# EAGLE design CV-module-schematics (EAGLE 6.2)
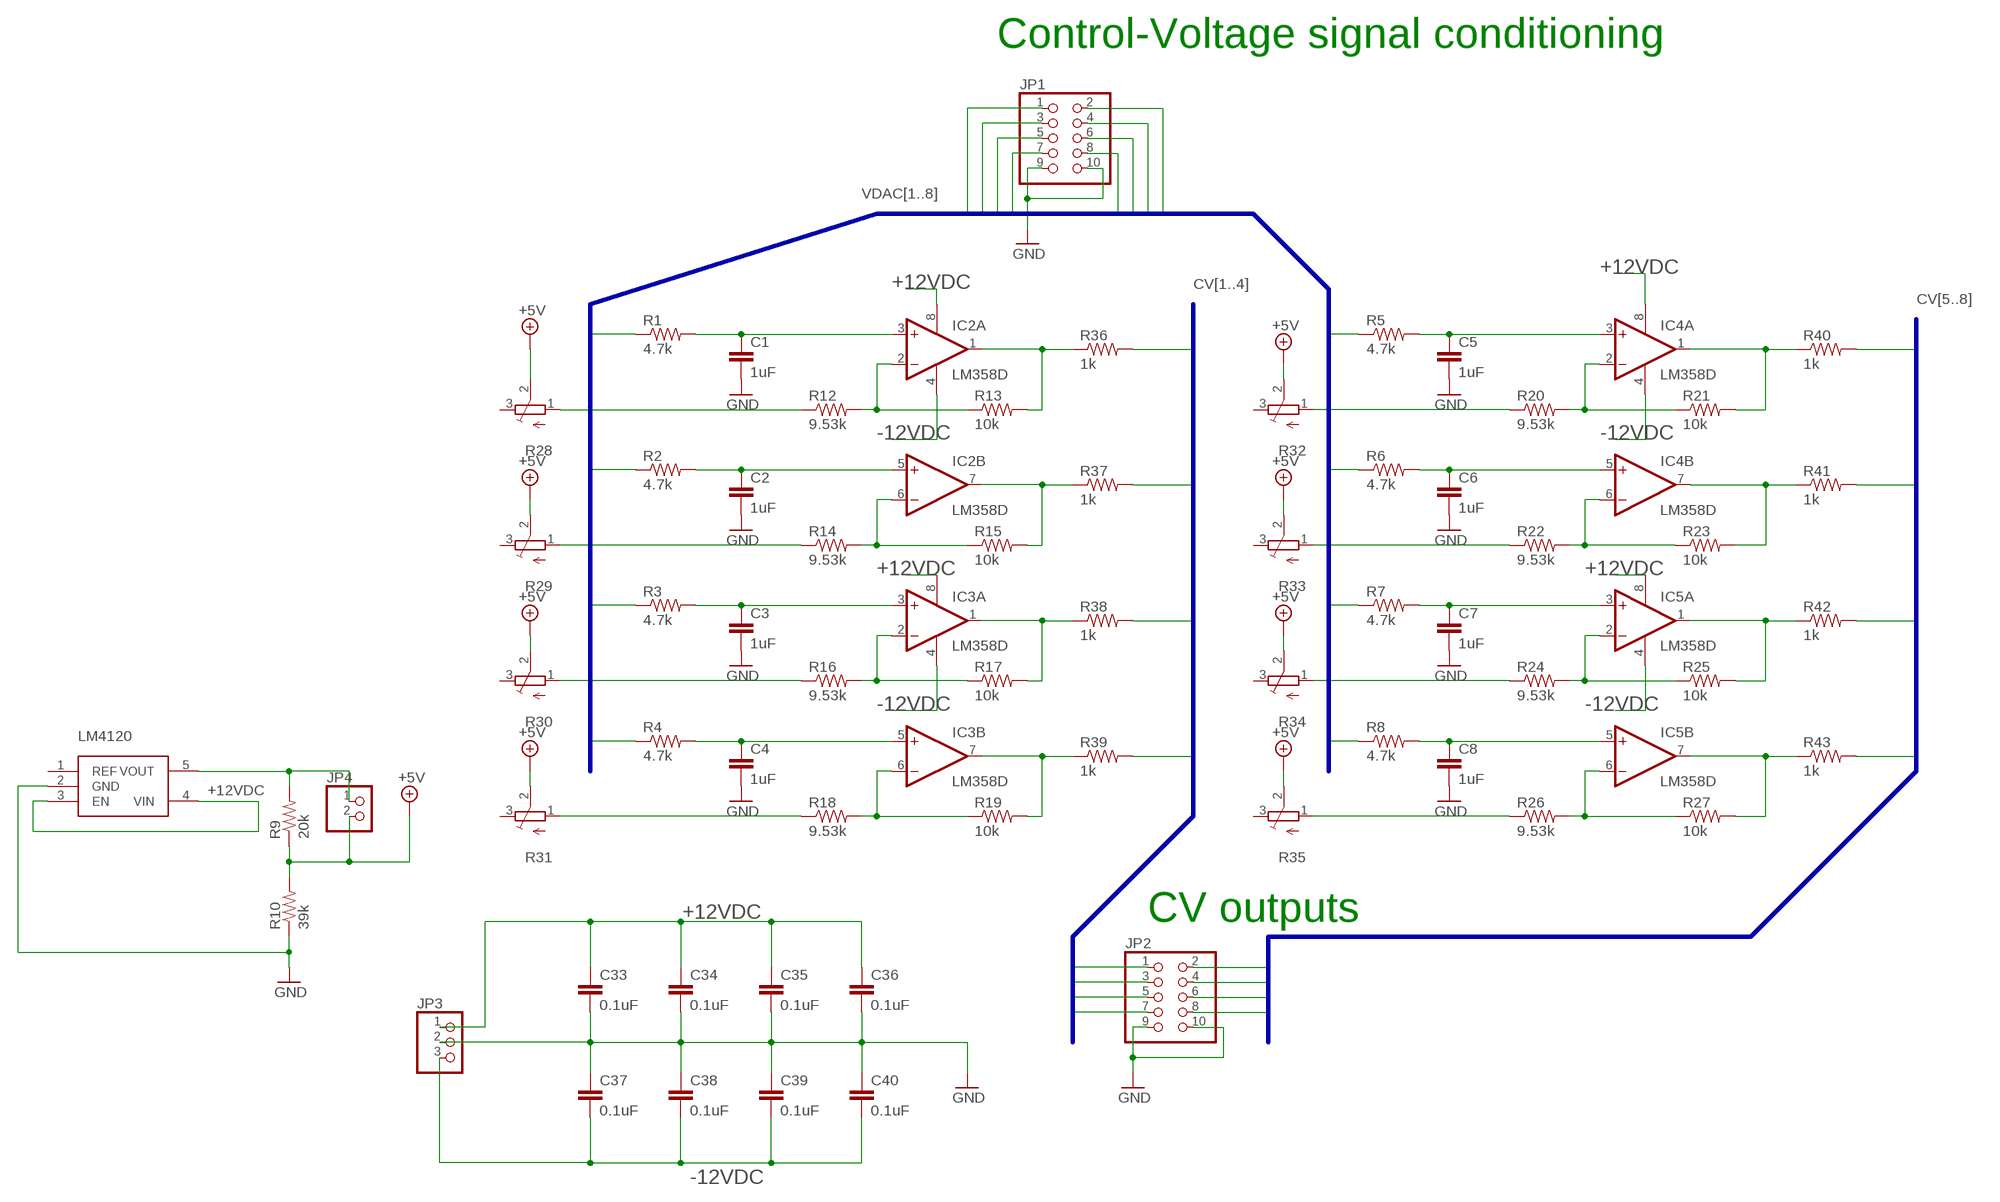
[diagram p0: schematic, sheet 1]

## Parts
C1  1uF  C-EUC0603  [C0603]
C2  1uF  C-EUC0603  [C0603]
C3  1uF  C-EUC0603  [C0603]
C4  1uF  C-EUC0603  [C0603]
C5  1uF  C-EUC0603  [C0603]
C6  1uF  C-EUC0603  [C0603]
C7  1uF  C-EUC0603  [C0603]
C8  1uF  C-EUC0603  [C0603]
C33  0.1uF  C-EUC0603  [C0603]
C34  0.1uF  C-EUC0603  [C0603]
C35  0.1uF  C-EUC0603  [C0603]
C36  0.1uF  C-EUC0603  [C0603]
C37  0.1uF  C-EUC0603  [C0603]
C38  0.1uF  C-EUC0603  [C0603]
C39  0.1uF  C-EUC0603  [C0603]
C40  0.1uF  C-EUC0603  [C0603]
IC2  LM358D  [SO08]
IC3  LM358D  [SO08]
IC4  LM358D  [SO08]
IC5  LM358D  [SO08]
JP1  PINHD-2X5  [2X05]
JP2  PINHD-2X5  [2X05]
JP3  PINHD-1X3  [1X03]
JP4  PINHD-1X2  [1X02]
LM4120  LM4120  [SOT23-5]
R1  4.7k  R-US_R0603  [R0603]
R2  4.7k  R-US_R0603  [R0603]
R3  4.7k  R-US_R0603  [R0603]
R4  4.7k  R-US_R0603  [R0603]
R5  4.7k  R-US_R0603  [R0603]
R6  4.7k  R-US_R0603  [R0603]
R7  4.7k  R-US_R0603  [R0603]
R8  4.7k  R-US_R0603  [R0603]
R9  20k  R-US_R0603  [R0603]
R10  39k  R-US_R0603  [R0603]
R12  9.53k  R-US_R0603  [R0603]
R13  10k  R-US_R0603  [R0603]
R14  9.53k  R-US_R0603  [R0603]
R15  10k  R-US_R0603  [R0603]
R16  9.53k  R-US_R0603  [R0603]
R17  10k  R-US_R0603  [R0603]
R18  9.53k  R-US_R0603  [R0603]
R19  10k  R-US_R0603  [R0603]
R20  9.53k  R-US_R0603  [R0603]
R21  10k  R-US_R0603  [R0603]
R22  9.53k  R-US_R0603  [R0603]
R23  10k  R-US_R0603  [R0603]
R24  9.53k  R-US_R0603  [R0603]
R25  10k  R-US_R0603  [R0603]
R26  9.53k  R-US_R0603  [R0603]
R27  10k  R-US_R0603  [R0603]
R28  TRIM_EU-3222W  [3222W]
R29  TRIM_EU-3222W  [3222W]
R30  TRIM_EU-3222W  [3222W]
R31  TRIM_EU-3222W  [3222W]
R32  TRIM_EU-3222W  [3222W]
R33  TRIM_EU-3222W  [3222W]
R34  TRIM_EU-3222W  [3222W]
R35  TRIM_EU-3222W  [3222W]
R36  1k  R-US_R0603  [R0603]
R37  1k  R-US_R0603  [R0603]
R38  1k  R-US_R0603  [R0603]
R39  1k  R-US_R0603  [R0603]
R40  1k  R-US_R0603  [R0603]
R41  1k  R-US_R0603  [R0603]
R42  1k  R-US_R0603  [R0603]
R43  1k  R-US_R0603  [R0603]

## Nets
+5V: JP4.2 R9.1 R10.2 R28.2(S) R29.2(S) R30.2(S) R31.2(S) R32.2(S) R33.2(S) R34.2(S) R35.2(S)
+12VDC: C33.1 C34.1 C35.1 C36.1 IC2.8(P:V+) IC3.8(P:V+) IC4.8(P:V+) IC5.8(P:V+) JP3.1 LM4120.3(EN) LM4120.4(VIN)
-12VDC: C37.2 C38.2 C39.2 C40.2 IC2.4(P:V-) IC3.4(P:V-) IC4.4(P:V-) IC5.4(P:V-) JP3.3
CV1: JP2.1 R37.2
CV2: JP2.3 R36.2
CV3: JP2.5 R39.2
CV4: JP2.7 R38.2
CV5: JP2.2 R42.2
CV6: JP2.4 R43.2
CV7: JP2.6 R40.2
CV8: JP2.8 R41.2
GND: C1.2 C2.2 C3.2 C4.2 C5.2 C6.2 C7.2 C8.2 C33.2 C34.2 C35.2 C36.2 C37.1 C38.1 C39.1 C40.1 JP1.9 JP1.10 JP2.9 JP2.10 JP3.2 LM4120.2(GND) R10.1
N$1: C1.1 IC2.3(A:+IN) R1.2
N$2: C2.1 IC2.5(B:+IN) R2.2
N$3: C3.1 IC3.3(A:+IN) R3.2
N$4: IC2.2(A:-IN) R12.2 R13.1
N$5: R12.1 R28.1(A)
N$6: IC2.1(A:OUT) R13.2 R36.1
N$7: R14.1 R29.1(A)
N$8: IC2.6(B:-IN) R14.2 R15.1
N$9: IC3.2(A:-IN) R16.2 R17.1
N$10: R16.1 R30.1(A)
N$11: IC3.6(B:-IN) R18.2 R19.1
N$12: R18.1 R31.1(A)
N$13: IC3.7(B:OUT) R19.2 R39.1
N$14: IC3.1(A:OUT) R17.2 R38.1
N$15: IC2.7(B:OUT) R15.2 R37.1
N$16: IC4.2(A:-IN) R20.2 R21.1
N$17: IC4.1(A:OUT) R21.2 R40.1
N$18: IC4.7(B:OUT) R23.2 R41.1
N$19: IC4.6(B:-IN) R22.2 R23.1
N$20: IC5.2(A:-IN) R24.2 R25.1
N$21: IC5.1(A:OUT) R25.2 R42.1
N$22: R24.1 R34.1(A)
N$23: IC5.6(B:-IN) R26.2 R27.1
N$24: IC5.7(B:OUT) R27.2 R43.1
N$25: R26.1 R35.1(A)
N$26: R20.1 R32.1(A)
N$27: R22.1 R33.1(A)
N$28: C4.1 IC3.5(B:+IN) R4.2
N$29: C5.1 IC4.3(A:+IN) R5.2
N$30: C6.1 IC4.5(B:+IN) R6.2
N$31: C7.1 IC5.3(A:+IN) R7.2
N$32: C8.1 IC5.5(B:+IN) R8.2
N$34: JP4.1 LM4120.5(VOUT) R9.2
VDAC1: JP1.1 R1.1
VDAC2: JP1.2 R2.1
VDAC3: JP1.3 R3.1
VDAC4: JP1.4 R4.1
VDAC5: JP1.5 R5.1
VDAC6: JP1.6 R6.1
VDAC7: JP1.7 R7.1
VDAC8: JP1.8 R8.1
Unconnected: LM4120.1(REF) R28.3(E) R29.3(E) R30.3(E) R31.3(E) R32.3(E) R33.3(E) R34.3(E) R35.3(E)

## Buses
CV[1..4]
CV[5..8]
VDAC[1..8]

## Notes on the sheet
- Control-Voltage signal conditioning
- CV outputs

## Library data of the parts
C1-C8 C33-C40 = resistor:C-EU: CAPACITOR, European symbol
IC2-IC5 = linear:LM358: OP AMP also LM158; LM258; LM2904 Source: http://cache.national.com/ds/LM/LM158.pdf
JP1 JP2 = pinhead:PINHD-2X5: PIN HEADER
JP3 = pinhead:PINHD-1X3: PIN HEADER
JP4 = pinhead:PINHD-1X2: PIN HEADER
LM4120 = Pekkas_libraries:LM4120: LM4120 Precision Micropower Low Dropout Voltage Reference
R1-R10 R12-R27 R36-R43 = resistor:R-US_: RESISTOR, American symbol
R28-R35 = Pekkas_libraries:TRIM_EU-: POTENTIOMETER

## Board
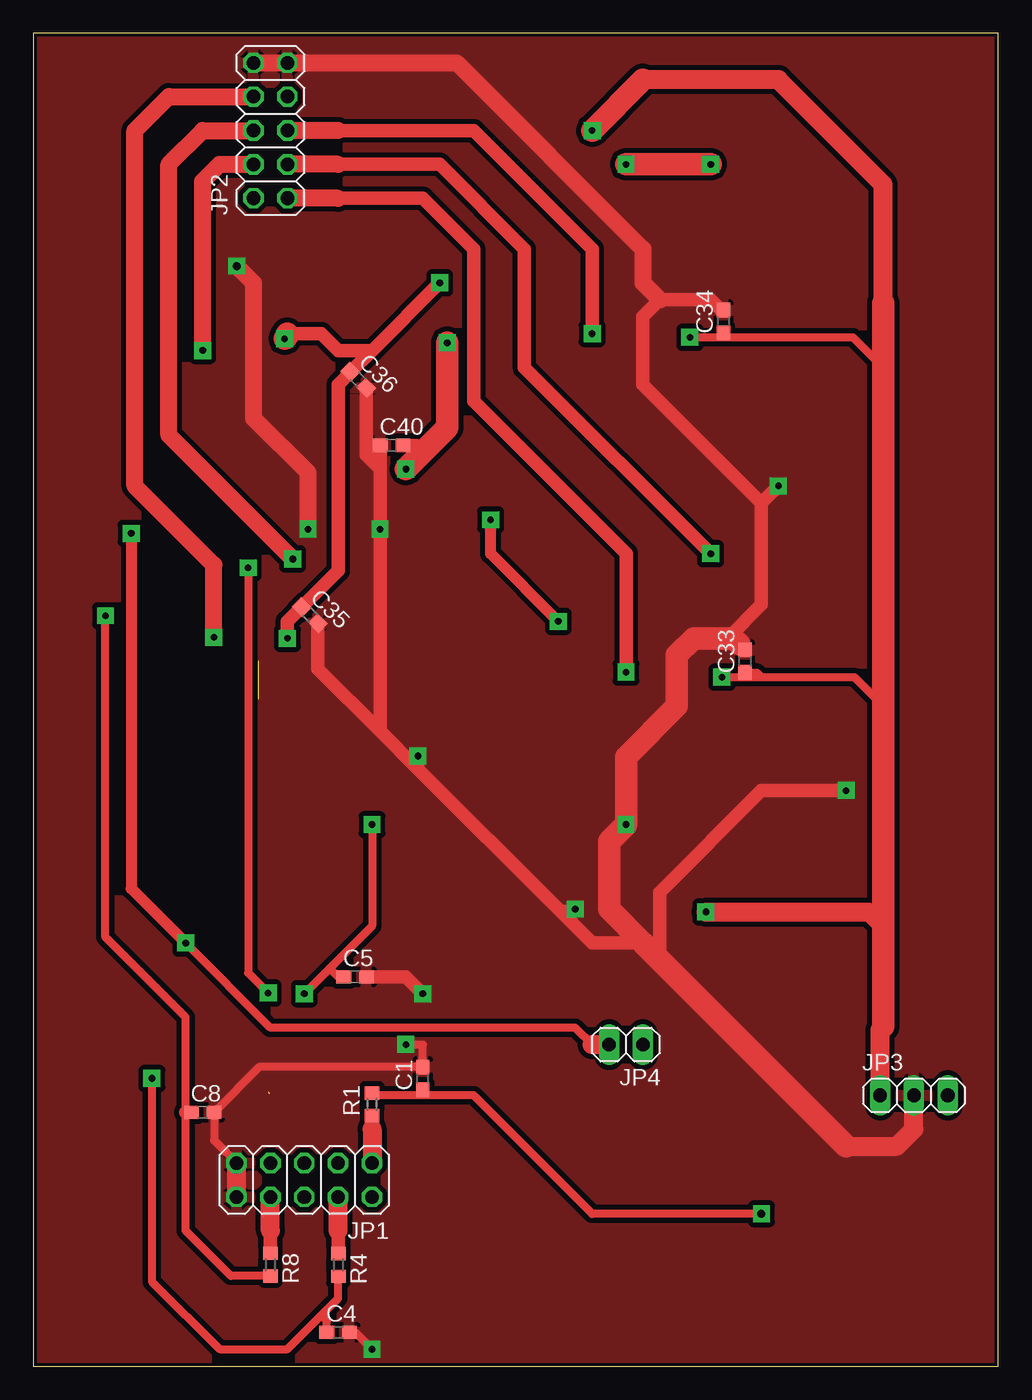
[diagram p1: board, top side]
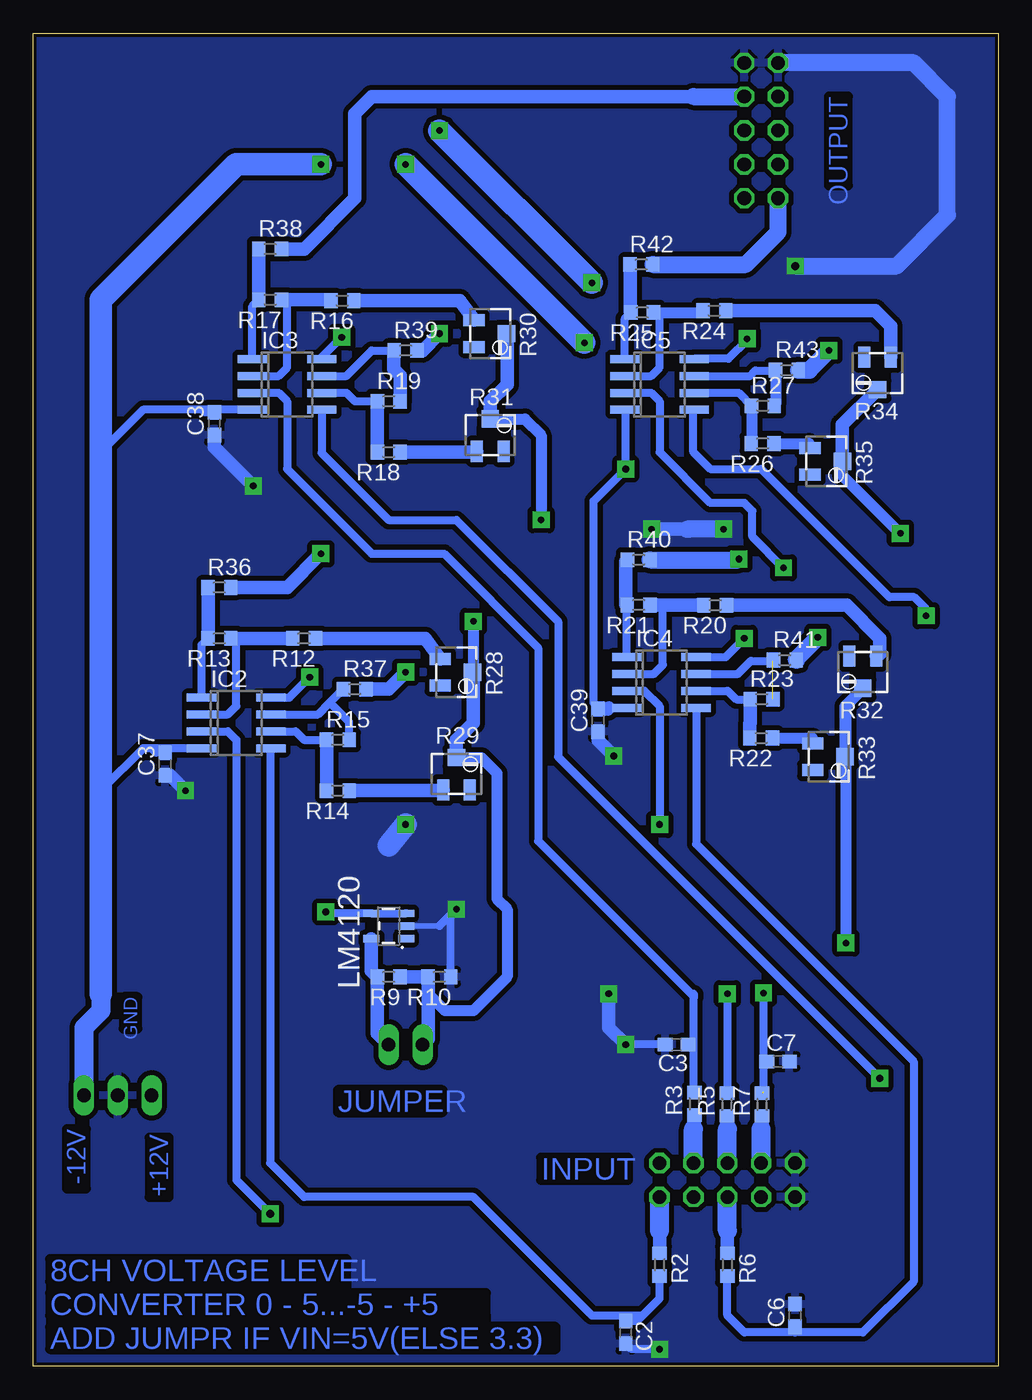
[diagram p2: board, bottom side, seen from below]

Size 72.37 x 100 mm. Coordinates in mm from the lower left corner, seen from the top.
Outline: 0,0 72.37,0 72.37,100 0,100 0,0
Copper layers (1*16): Top 0.035mm / dielectric 1.5mm / Bottom 0.035mm
Design rules: minimum track width 10mil, minimum drill 24mil, track to track 15mil, track to pad 10mil, pad to pad 10mil, via to via 10mil, smd to smd 8mil, copper to edge 10mil, drill to drill 8mil, minimum pad ring 10mil, minimum via ring 8mil, stop-mask expansion 4mil, vias tented up to drill 0mil, thermal gap 10mil

### Footprints (pad centres in the part's own frame; a part is rotated, then mirrored left to right if it is on the bottom)
C0603 = smd 1.1 x 1: 1 -0.85,0; 2 0.85,0
SO08 = smd 0.6 x 2.2: 1 -1.905,-2.6; 2 -0.635,-2.6; 3 0.635,-2.6; 4 1.905,-2.6; 5 1.905,2.6; 6 0.635,2.6; 7 -0.635,2.6; 8 -1.905,2.6
2X05 = drill 1.016 octagon: 1 -5.08,-1.27; 2 -5.08,1.27; 3 -2.54,-1.27; 4 -2.54,1.27; 5 0,-1.27; 6 0,1.27; 7 2.54,-1.27; 8 2.54,1.27; 9 5.08,-1.27; 10 5.08,1.27
1X03 = drill 1.016 long: 1 -2.54,0; 2 0,0; 3 2.54,0
1X02 = drill 1.016 long: 1 -1.27,0; 2 1.27,0
SOT23-5 = smd 0.55 x 1.2: 1 -0.95,-1.3; 2 0,-1.3; 3 0.95,-1.3; 4 0.95,1.3; 5 -0.95,1.3
R0603 = smd 1 x 1.1: 1 -0.85,0; 2 0.85,0
3222W = smd 0.9 x 1.6: 1 -1,-1.215; 3 1,-1.215 | smd 1.3 x 1.3: 2 0,1.215

### Placement (x,y rotation side)
C1  29.21,21.59 90 top
C2  27.94,2.54 270 bottom
C3  24.13,24.13 180 bottom
C4  22.86,2.54 0 top
C5  24.13,29.21 0 top
C6  15.24,3.81 90 bottom
C7  16.51,22.86 0 bottom
C8  12.7,19.05 0 top
C33  53.38,52.89 90 top
C34  51.76,78.38 90 top
C35  20.74,56.34 315 top
C36  24.37,74.01 315 top
C37  62.48,45.18 90 bottom
C38  58.79,70.71 90 bottom
C39  30.01,48.46 90 bottom
C40  26.87,69.08 0 top
IC2  57.15,48.26 270 bottom
IC3  53.34,73.66 270 bottom
IC4  25.26,51.3 270 bottom
IC5  25.4,73.66 270 bottom
JP1  20.32,13.97 180 top
JP2  17.78,92.71 90 top
JP3  66.04,20.32 0 top
JP4  44.45,24.13 180 top
LM4120  45.72,33.02 90 bottom
R1  25.4,19.65 90 top
R2  25.4,7.62 270 bottom
R3  22.79,19.68 90 bottom
R4  22.88,7.59 270 top
R5  20.35,19.63 90 bottom
R6  20.32,7.62 270 bottom
R7  17.71,19.63 90 bottom
R8  17.78,7.62 270 top
R9  45.72,29.21 180 bottom
R10  41.91,29.21 180 bottom
R12  52.07,54.61 180 bottom
R13  58.42,54.61 180 bottom
R14  49.53,43.18 180 bottom
R15  49.53,46.99 0 bottom
R16  49.19,79.94 180 bottom
R17  54.61,80.01 180 bottom
R18  45.72,68.58 180 bottom
R19  45.72,72.39 0 bottom
R20  21.24,57.1 180 bottom
R21  26.98,57.11 180 bottom
R22  17.79,47.13 180 bottom
R23  17.75,50.05 0 bottom
R24  21.29,79.19 180 bottom
R25  26.7,79.06 180 bottom
R26  17.68,69.22 180 bottom
R27  17.65,72.05 0 bottom
R28  40.64,52.07 270 bottom
R29  40.64,44.45 0 bottom
R30  38.1,77.47 270 bottom
R31  38.1,69.85 0 bottom
R32  10.16,52.07 180 bottom
R33  12.7,45.72 270 bottom
R34  9.05,74.49 180 bottom
R35  12.9,67.89 270 bottom
R36  58.42,58.42 0 bottom
R37  48.26,50.8 0 bottom
R38  54.61,83.82 0 bottom
R39  44.45,76.2 0 bottom
R40  26.96,60.5 0 bottom
R41  16,52.98 0 bottom
R42  26.76,82.65 0 bottom
R43  15.85,74.73 0 bottom

### Tracks (layer width: path | path; a pad name or v marks a point on that pad's centre or on a via)
+5V  (via drill 0.5 pad 1.27)
  Top 0.61: v11.43,31.75 17.78,25.4 40.64,25.4 41.91,24.13
  Top 0.813: v7.34,62.48 7.34,35.84 v11.43,31.75 | v39.37,55.88 34.29,60.96 v34.29,63.5
  Top 1.422: 41.91,24.13 JP4.2
  Bottom 0.813: R33.2 11.48,49.53 R32.2 10.16,50.8 11.43,49.53 v11.43,31.75 | R31.2 35.51,71.06 34.29,69.85 v34.29,63.5 | v39.37,55.88 39.37,52.12 R28.2 | R35.2 11.69,66.83 v7.34,62.48 | 42.76,27.94 41.49,26.67 39.37,26.67 36.83,29.21 36.83,34.29 37.6,35.06 37.6,44.5 38.77,45.66 R29.2
  Bottom 1.016: R35.2 11.69,70.64 R34.2 | R31.2 38.1,72.39 36.83,73.66 36.83,77.42 R30.2 | R29.2 40.64,46.99 39.37,48.26 39.37,52.02 R28.2 | R9.1 R10.2 42.76,27.94 42.76,24.55 JP4.2
+12VDC  (via drill 0.5 pad 1.27)
  Top 0.61: v51.64,51.7 54.61,51.7 | 54.61,51.7 61.57,51.7 63.74,49.53 | v49.24,77.2 52.07,77.2 | 52.07,77.2 61.47,77.2 63.74,74.93 | C33.1 54.27,52.04 54.61,51.7 | C34.1 51.76,77.51 52.07,77.2
  Top 1.016: v19.05,54.61 19.05,55.88 20.12,56.95 | 20.12,56.95 22.86,59.69 22.86,73.66 23.81,74.61 | 25.4,76.2 v30.48,81.28 | C35.1 20.12,56.95 | 19.05,77.47 21.59,77.47 22.86,76.2 25.4,76.2 | C36.1 23.81,74.61 | 23.81,74.61 25.4,76.2
  Top 1.422: 63.74,79.77 63.74,88.66 55.88,96.52 45.72,96.52 | v50.44,34.08 62.68,34.08 63.74,33.02 | JP3.1 63.5,25.24 63.74,25.48
  Top 1.676: 63.74,25.48 63.74,33.02 63.74,49.53 63.74,74.93 63.74,79.77 | 19.05,77.47 19.05,77.29 v18.84,77.08 | 45.72,96.52 v41.91,92.71
  Bottom 0.61: IC2.8 53.17,50.16 v51.64,51.7 | IC3.8 50.74,75.7 v49.24,77.2 | v18.84,77.08 18.84,76.98 20.24,75.58 22.79,75.58 IC5.8 | IC4.8 20.45,53.2 v19.05,54.61 | LM4120.3 LM4120.4 50.33,33.97 v50.44,34.08
  Bottom 1.676: v41.91,92.71 v30.48,81.28
-12VDC  (via drill 0.5 pad 1.27)
  Top 1.016: C40.2 28.71,69.08 29.21,68.58
  Top 1.676: v50.8,90.17 v44.45,90.17 | v31.04,76.78 31.04,70.41 29.21,68.58 v27.94,67.31
  Bottom 0.61: IC2.4 63.5,46.35 | 63.5,46.35 64.14,46.35 67.31,43.18 | IC3.4 59.69,71.75 | 59.69,71.75 64.14,71.75 67.31,68.58 | C37.2 63.17,46.03 63.5,46.35 | C38.2 59.49,71.56 59.69,71.75 | IC5.4 27.94,71.69 v27.94,67.31 30.34,64.91 30.34,49.78 29.95,49.4 29.21,49.4 IC4.4
  Bottom 1.016: C39.2 29.3,49.31 29.21,49.4
  Bottom 1.422: 67.31,27.94 67.31,26.67 68.58,25.4 JP3.3
  Bottom 1.676: 67.31,27.94 67.31,43.18 67.31,68.58 67.31,80.01 57.15,90.17 v50.8,90.17 | v44.45,90.17 41.89,87.63 v31.04,76.78
CV1  (via drill 0.5 pad 1.27)
  Top 1.016: 22.86,87.63 29.21,87.63 33.02,83.82 33.02,72.39 44.45,60.96 v44.45,52.07
  Top 1.27: 22.86,87.63 JP2.1
  Bottom 1.016: v44.45,52.07 45.72,50.8 R37.2
CV2  (via drill 0.5 pad 1.27)
  Top 1.016: v50.8,60.96 36.83,74.93 36.83,83.82 30.48,90.17 22.86,90.17
  Top 1.27: 22.86,90.17 JP2.3
  Bottom 1.016: R36.2 53.34,58.42 v50.8,60.96
CV3  (via drill 0.5 pad 1.27)
  Top 1.016: v41.91,77.47 41.91,83.82 33.02,92.71 22.86,92.71
  Top 1.27: 22.86,92.71 JP2.5
  Bottom 1.016: R39.2 43.18,76.2 v41.91,77.47
CV4
  Bottom 1.016: 22.86,95.25 46.99,95.25 48.26,93.98 48.26,87.63 52.07,83.82 R38.2
  Bottom 1.27: 22.86,95.25 JP2.7
CV5
  Bottom 1.27: R42.2 18.95,82.65 16.51,85.09 JP2.2
CV6  (via drill 0.5 pad 1.27)
  Top 1.27: v12.7,76.2 12.7,88.9 13.97,90.17 JP2.4
  Bottom 1.27: R43.2 14.17,74.73 v12.7,76.2
CV7  (via drill 0.5 pad 1.27)
  Top 1.27: v19.45,60.56 10.16,69.85 10.16,90.17 12.7,92.71 JP2.6
  Bottom 1.27: R40.2 19.51,60.5 v19.45,60.56
CV8  (via drill 0.5 pad 1.27)
  Top 1.27: v13.54,54.68 13.54,60.12 7.62,66.04 7.62,92.71 10.16,95.25 JP2.8
  Bottom 1.27: R41.2 15.15,53.07 v13.54,54.68
GND  (via drill 0.5 pad 1.27, 0.6 pad 1.27)
  Top 0.61: v40.64,34.29 39.37,34.29 | JP1.9 13.55,16.93 C8.2 16.94,22.44 C1.2 29.21,24.13 v27.94,24.13 | C4.2 24.13,2.54 v25.4,1.27
  Top 1.016: 52.94,54.18 C33.2 | C34.2 51.58,79.23 50.8,80.01 46.99,80.01 45.72,78.74 45.72,73.66 54.61,64.77 | 54.61,64.77 54.61,57.15 52.07,54.61 | v55.88,66.04 54.61,64.77 | v60.96,43.18 54.61,43.18 46.99,35.56 46.99,30.48 | v28.84,45.78 28.84,44.82 | 28.84,44.82 39.37,34.29 41.91,31.75 45.72,31.75 | C40.1 26.02,67.31 | 26.02,67.31 26.02,47.64 | 26.02,47.64 28.84,44.82 | C35.2 21.34,52.32 26.02,47.64 | C36.2 24.97,68.36 26.02,67.31 | C5.2 27.94,29.21 v29.21,27.94
  Top 1.27: JP2.10 JP2.9 31.75,97.79 45.72,83.82 45.72,81.28 46.99,80.01 | v20.6,62.8 20.6,67.03 16.51,71.12 16.51,81.28 v15.24,82.55
  Top 1.422: 60.96,16.51 64.77,16.51 66.04,17.78 JP3.2 | JP1.10 JP1.9
  Top 1.676: 60.96,16.51 46.99,30.48 45.72,31.75 43.18,34.29 43.18,39.37 v44.45,40.64 44.45,45.72 48.26,49.53 48.26,53.34 49.53,54.61 52.07,54.61 52.51,54.61 52.94,54.18
  Bottom 0.406: 44.45,33.02 41.91,33.02
  Bottom 0.61: 41.91,33.02 v40.64,34.29 41.06,33.87 R10.1 | v25.4,1.27 27.52,1.27 C2.2 | C3.2 v27.94,24.13
  Bottom 1.016: C38.1 58.79,68.95 v55.88,66.04 | C37.1 62.11,44.33 v60.96,43.18 | C39.1 30.01,46.95 v28.84,45.78 | 26.1,62.8 v26,62.8 23.2,62.8 | v29.21,27.94 29.21,25.4 v27.94,24.13
  Bottom 1.27: v15.24,82.55 7.62,82.55 3.81,86.36 3.81,95.25 6.35,97.79 JP2.10 | v20.6,62.8 23.2,62.8 23.36,62.8
  Bottom 1.676: v44.45,40.64 45.72,39.06
  pour Bottom: 0,100.33 0,0 72.39,0 72.39,100.33
  pour Top: 0,100.33 0,0 72.39,0 72.39,100.33
N$1  (via drill 0.6 pad 1.27)
  Top 0.61: v54.61,11.43 41.91,11.43 33.02,20.32 29.21,20.32 | 29.21,20.32 25.58,20.32 R1.2 | C1.1 29.21,20.32
  Bottom 0.61: IC2.3 57.78,47.62 57.15,46.99 57.15,13.97 v54.61,11.43
N$2
  Bottom 0.61: IC2.5 54.61,46.35 54.61,15.24 52.07,12.7 39.37,12.7 30.48,3.81 26.67,3.81 | 26.67,3.81 25.4,5.08 R2.2 | C2.1 27.09,3.39 26.67,3.81
N$3
  Bottom 0.61: IC3.3 53.98,73.03 53.34,72.39 53.34,67.31 46.99,60.96 41.57,60.96 34.51,53.9 34.51,39.4 22.81,27.7 22.81,27.89 22.86,27.94 22.86,24.13 | 22.86,24.13 22.86,20.6 R3.2 | C3.1 22.86,24.13
N$4
  Bottom 0.61: IC2.2 57.78,48.9 57.15,49.53 57.15,54.19 R13.1
  Bottom 1.016: R13.1 R12.2
N$5
  Bottom 1.016: R12.1 42.99,54.61 R28.1
N$6
  Bottom 0.61: IC2.1 59.75,54.13 R13.2
  Bottom 1.016: R13.2 R36.1
N$7
  Bottom 1.016: R14.1 42.09,43.18 R29.1
N$8
  Bottom 0.61: IC2.6 52.7,47.62 52.07,46.99 R15.1
  Bottom 1.016: R15.1 R14.2
N$9
  Bottom 0.61: IC3.2 53.98,74.3 53.34,74.93 53.34,79.59 R17.1
  Bottom 1.016: R17.1 50.11,80.01 R16.2
N$10
  Bottom 1.016: R16.1 40.38,79.94 R30.1
N$11
  Bottom 0.61: IC3.6 48.9,73.03 48.26,72.39 R19.1
  Bottom 1.016: R19.1 R18.2
N$12
  Bottom 1.016: R18.1 39.55,68.58 R31.1
N$13
  Bottom 0.61: IC3.7 48.9,74.3 46.99,76.2 R39.1
  Bottom 1.016: R19.2 44.87,74.31 45.35,74.79 45.35,76.15 R39.1
N$14
  Bottom 0.61: IC3.1 55.94,79.53 R17.2
  Bottom 1.016: R17.2 R38.1
N$15
  Bottom 0.61: IC2.7 51.02,48.9 50.12,49.78 | 50.12,49.78 R37.1 | R15.2 48.68,48.34 50.12,49.78
N$16
  Bottom 0.61: IC4.2 25.84,51.94 25.15,52.62 25.15,56.86 25.4,57.11
  Bottom 1.016: R21.1 25.4,57.11 R20.2
N$17
  Bottom 0.61: IC4.1 27.86,57.08 R21.2
  Bottom 1.016: R21.2 27.9,57.11 27.94,57.15 27.94,60.37 R40.1
N$18  (1 unrouted)
  Bottom 0.61: IC4.7 19.54,51.94 18.55,52.92 16.91,52.92 R41.1
N$19
  Bottom 0.61: IC4.6 20.3,50.66 19.65,50.02 18.63,50.02 R23.1
  Bottom 1.016: R23.1 18.6,48.27 18.65,48.22 R22.2
N$20
  Bottom 0.61: IC5.2 26.04,74.3 25.4,74.93 25.4,78.74 25.53,78.74 R25.1
  Bottom 0.813: R25.1 22.27,79.06 R24.2
N$21
  Bottom 0.61: IC5.1 28,78.61 R25.2
  Bottom 1.016: R42.1 27.61,79.12 R25.2
N$22
  Bottom 1.016: R34.1 8.05,78.04 9.21,79.2 R24.1
N$23
  Bottom 0.61: IC5.6 19.48,73.03 R27.1
  Bottom 0.813: R27.1 18.5,69.25 R26.2
N$24
  Bottom 0.61: IC5.7 18.61,74.3 18.21,74.7 16.73,74.7 R43.1
  Bottom 0.813: R43.1 16.7,72.15 R27.2
N$25
  Bottom 0.813: R26.1 14.19,69.22 R35.1
N$26
  Bottom 1.016: R20.1 11.38,57.1 8.89,54.61 8.89,53.41 R32.1
N$27
  Bottom 0.813: R22.1 13.93,47.13 R33.1
N$28  (via drill 0.5 pad 1.27)
  Top 0.61: v8.89,21.59 8.89,6.35 13.97,1.27 19.05,1.27 21.59,3.81 | 21.59,3.81 22.86,5.08 22.86,6.72 R4.2 | C4.1 22.01,3.39 21.59,3.81
  Bottom 0.61: IC3.5 50.74,68.52 45.72,63.5 40.64,63.5 33.02,55.88 33.02,45.72 v8.89,21.59
N$29  (via drill 0.5 pad 1.27)
  Top 0.61: v25.4,40.64 25.4,33.02 22.23,29.84 | 22.23,29.84 v20.32,27.94 | C5.1 22.86,29.21 22.23,29.84
  Bottom 0.61: IC4.3 26.54,50.66 25.4,49.53 v25.4,40.64 | v20.32,27.94 20.32,20.51 R5.2
N$30
  Bottom 0.61: IC4.5 22.66,39.17 6.35,22.86 6.35,6.35 10.16,2.54 15.24,2.54 | 15.24,2.54 19.05,2.54 20.32,3.81 R6.2 | C6.1 15.24,2.54
N$31  (via drill 0.5 pad 1.27)  (1 unrouted)
  Top 0.61: v16.11,59.9 16.11,29.5 v17.61,28
  Bottom 0.61: IC5.3 26.04,73.03 25.4,72.39 25.4,68.58 21.59,64.77 19.05,64.77 18.44,64.16 18.44,62.23 v16.11,59.9 | v17.61,28 17.61,22.86 | 17.61,22.86 17.61,20.58 | C7.1 17.61,22.86
N$32  (via drill 0.5 pad 1.27)
  Top 0.61: R8.2 14.82,6.77 11.43,10.16 11.43,19.05 11.43,26.18 5.41,32.2 v5.41,56.3
  Top 1.016: C8.1 11.43,19.05
  Bottom 0.61: v5.41,56.3 5.41,56.8 6.31,57.7 8.17,57.7 17.78,67.31 21.59,67.31 22.86,68.58 22.86,71.69 IC5.5
N$34
  Bottom 1.016: JP4.1 46.57,24.98 R9.2 47.02,29.66 LM4120.5
VDAC1
  Top 1.016: R1.1 25.4,17.78
  Top 1.422: 25.4,17.78 JP1.1
VDAC2
  Bottom 1.016: R2.1 25.4,10.16
  Bottom 1.422: 25.4,10.16 JP1.2
VDAC3
  Bottom 1.016: R3.1 22.79,17.85 22.86,17.78
  Bottom 1.422: JP1.3 22.86,17.78
VDAC4
  Top 1.016: R4.1 22.88,10.14 22.86,10.16
  Top 1.422: 22.86,10.16 JP1.4
VDAC5
  Bottom 1.016: R5.1 20.35,17.81 20.32,17.78
  Bottom 1.422: JP1.5 20.32,17.78
VDAC6
  Bottom 1.016: R6.1 20.32,10.16
  Bottom 1.422: 20.32,10.16 JP1.6
VDAC7
  Bottom 1.016: R7.1 17.71,17.85 17.78,17.78
  Bottom 1.422: JP1.7 17.78,17.78
VDAC8
  Top 1.016: R8.1 17.78,10.16
  Top 1.422: 17.78,10.16 JP1.8

### Text on the board
Bottom: OUTPUT | GND | JUMPER | -12V | INPUT | +12V | 8CH VOLTAGE LEVEL | CONVERTER 0 - 5...-5 - +5 | ADD JUMPR IF VIN=5V(ELSE 3.3)